# Altium schematic sheet CANOPi_Topboard_USB3.SchDoc
size A3; DocumentNumber: 2; SheetNumber: 2; SheetTotal: 2; CopyrightYear: 2021
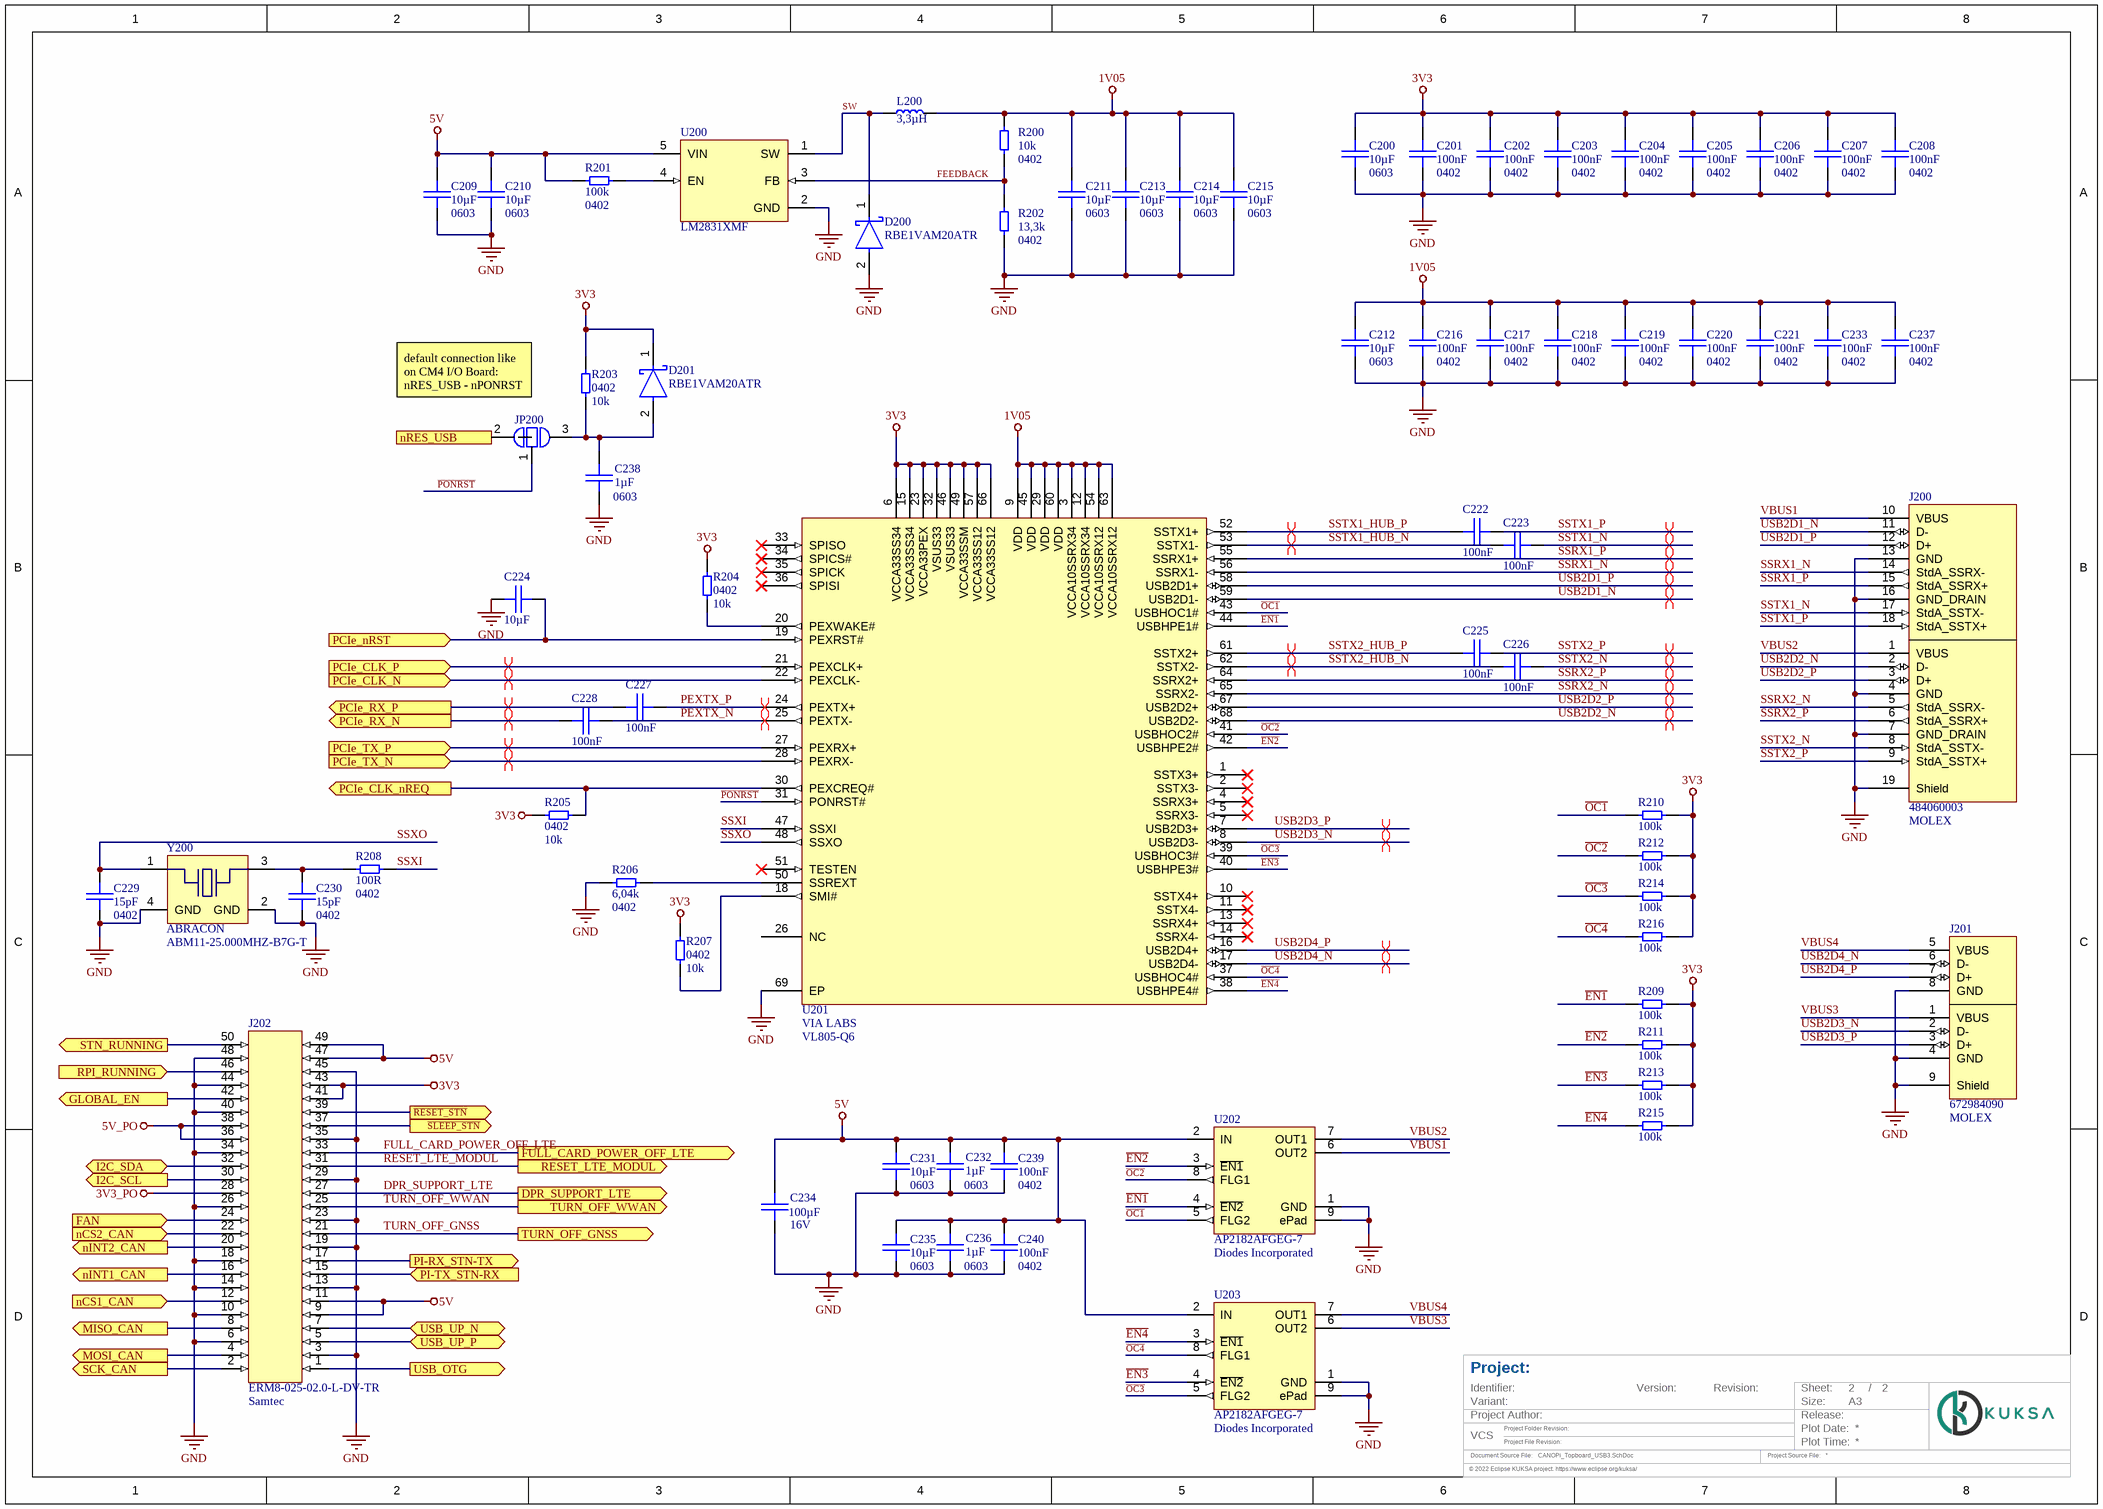
[diagram p0: CANOPi_Topboard_USB3.SchDoc]

## Parts
C200  Capacitance: 10µF  Case: 0603  [CAP 0603 [1608 Metric] X080 N]  (hidden comment: CAP 0603 10µF -20% +20% 6.3V X5R)
C201  Capacitance: 100nF  Case: 0402  [CAP 0402 [1005 Metric] X050 N]  (hidden comment: CAP 0402 100n -10% +10% 6.3V X7R)
C202  Capacitance: 100nF  Case: 0402  [CAP 0402 [1005 Metric] X050 N]  (hidden comment: CAP 0402 100n -10% +10% 6.3V X7R)
C203  Capacitance: 100nF  Case: 0402  [CAP 0402 [1005 Metric] X050 N]  (hidden comment: CAP 0402 100n -10% +10% 6.3V X7R)
C204  Capacitance: 100nF  Case: 0402  [CAP 0402 [1005 Metric] X050 N]  (hidden comment: CAP 0402 100n -10% +10% 6.3V X7R)
C205  Capacitance: 100nF  Case: 0402  [CAP 0402 [1005 Metric] X050 N]  (hidden comment: CAP 0402 100n -10% +10% 6.3V X7R)
C206  Capacitance: 100nF  Case: 0402  [CAP 0402 [1005 Metric] X050 N]  (hidden comment: CAP 0402 100n -10% +10% 6.3V X7R)
C207  Capacitance: 100nF  Case: 0402  [CAP 0402 [1005 Metric] X050 N]  (hidden comment: CAP 0402 100n -10% +10% 6.3V X7R)
C208  Capacitance: 100nF  Case: 0402  [CAP 0402 [1005 Metric] X050 N]  (hidden comment: CAP 0402 100n -10% +10% 6.3V X7R)
C209  Capacitance: 10µF  Case: 0603  [CAP 0603 [1608 Metric] X080 N]  (hidden comment: CAP 0603 10µF -20% +20% 6.3V X5R)
C210  Capacitance: 10µF  Case: 0603  [CAP 0603 [1608 Metric] X080 N]  (hidden comment: CAP 0603 10µF -20% +20% 6.3V X5R)
C211  Capacitance: 10µF  Case: 0603  [CAP 0603 [1608 Metric] X080 N]  (hidden comment: CAP 0603 10µF -20% +20% 6.3V X5R)
C212  Capacitance: 10µF  Case: 0603  [CAP 0603 [1608 Metric] X080 N]  (hidden comment: CAP 0603 10µF -20% +20% 6.3V X5R)
C213  Capacitance: 10µF  Case: 0603  [CAP 0603 [1608 Metric] X080 N]  (hidden comment: CAP 0603 10µF -20% +20% 6.3V X5R)
C214  Capacitance: 10µF  Case: 0603  [CAP 0603 [1608 Metric] X080 N]  (hidden comment: CAP 0603 10µF -20% +20% 6.3V X5R)
C215  Capacitance: 10µF  Case: 0603  [CAP 0603 [1608 Metric] X080 N]  (hidden comment: CAP 0603 10µF -20% +20% 6.3V X5R)
C216  Capacitance: 100nF  Case: 0402  [CAP 0402 [1005 Metric] X050 N]  (hidden comment: CAP 0402 100n -10% +10% 6.3V X7R)
C217  Capacitance: 100nF  Case: 0402  [CAP 0402 [1005 Metric] X050 N]  (hidden comment: CAP 0402 100n -10% +10% 6.3V X7R)
C218  Capacitance: 100nF  Case: 0402  [CAP 0402 [1005 Metric] X050 N]  (hidden comment: CAP 0402 100n -10% +10% 6.3V X7R)
C219  Capacitance: 100nF  Case: 0402  [CAP 0402 [1005 Metric] X050 N]  (hidden comment: CAP 0402 100n -10% +10% 6.3V X7R)
C220  Capacitance: 100nF  Case: 0402  [CAP 0402 [1005 Metric] X050 N]  (hidden comment: CAP 0402 100n -10% +10% 6.3V X7R)
C221  Capacitance: 100nF  Case: 0402  [CAP 0402 [1005 Metric] X050 N]  (hidden comment: CAP 0402 100n -10% +10% 6.3V X7R)
C222  Capacitance: 100nF  [CAP 0402 [1005 Metric] X050 N]  (hidden comment: CAP 0402 100n -10% +10% 6.3V X7R)
C223  Capacitance: 100nF  [CAP 0402 [1005 Metric] X050 N]  (hidden comment: CAP 0402 100n -10% +10% 6.3V X7R)
C224  Capacitance: 10µF  [CAP 0603 [1608 Metric] X080 N]  (hidden comment: CAP 0603 10µF -20% +20% 6.3V X5R)
C225  Capacitance: 100nF  [CAP 0402 [1005 Metric] X050 N]  (hidden comment: CAP 0402 100n -10% +10% 6.3V X7R)
C226  Capacitance: 100nF  [CAP 0402 [1005 Metric] X050 N]  (hidden comment: CAP 0402 100n -10% +10% 6.3V X7R)
C227  Capacitance: 100nF  [CAP 0402 [1005 Metric] X050 N]  (hidden comment: CAP 0402 100n -10% +10% 6.3V X7R)
C228  Capacitance: 100nF  [CAP 0402 [1005 Metric] X050 N]  (hidden comment: CAP 0402 100n -10% +10% 6.3V X7R)
C229  Case: 0402  Capacitance: 15pF  [CAP 0402 [1005 Metric] X050 N]  (hidden comment: CAP 0402 15p -2% +2% 25V C0G)
C230  Case: 0402  Capacitance: 15pF  [CAP 0402 [1005 Metric] X050 N]  (hidden comment: CAP 0402 15p -2% +2% 25V C0G)
C231  Capacitance: 10µF  Case: 0603  [CAP 0603 [1608 Metric] X080 N]  (hidden comment: CAP 0603 10µF -20% +20% 6.3V X5R)
C232  Capacitance: 1µF  Case: 0603  [CAP 0603 [1608 Metric] X080 N]  (hidden comment: CAP 0603 1u -10% +10% 10V X7R)
C233  Capacitance: 100nF  Case: 0402  [CAP 0402 [1005 Metric] X050 N]  (hidden comment: CAP 0402 100n -10% +10% 6.3V X7R)
C234  Voltage Rating: 16V  Capacitance: 100µF  [CAP 1210 [3225 Metric] X250 N]  (hidden comment: CAP 1210 100µF +/-20% 16V X5R)
C235  Capacitance: 10µF  Case: 0603  [CAP 0603 [1608 Metric] X080 N]  (hidden comment: CAP 0603 10µF -20% +20% 6.3V X5R)
C236  Capacitance: 1µF  Case: 0603  [CAP 0603 [1608 Metric] X080 N]  (hidden comment: CAP 0603 1u -10% +10% 10V X7R)
C237  Capacitance: 100nF  Case: 0402  [CAP 0402 [1005 Metric] X050 N]  (hidden comment: CAP 0402 100n -10% +10% 6.3V X7R)
C238  Capacitance: 1µF  Case: 0603  [CAP 0603 [1608 Metric] X080 N]  (hidden comment: CAP 0603 1u -10% +10% 10V X7R)
C239  Capacitance: 100nF  Case: 0402  [CAP 0402 [1005 Metric] X050 N]  (hidden comment: CAP 0402 100n -10% +10% 6.3V X7R)
C240  Capacitance: 100nF  Case: 0402  [CAP 0402 [1005 Metric] X050 N]  (hidden comment: CAP 0402 100n -10% +10% 6.3V X7R)
D200  RBE1VAM20ATR  [FP-TUMD2M-MFG]
D201  RBE1VAM20ATR  [FP-TUMD2M-MFG]
J200  Manufacturer Part Number: 484060003  Manufacturer: MOLEX  [MOLEX - 484060003]  (hidden comment: MOLEX - 484060003)
J201  Manufacturer Part Number: 672984090  Manufacturer: MOLEX  [MOLEX - 672984090]  (hidden comment: MOLEX - 672984090)
J202  Manufacturer Part Number: ERM8-025-02.0-L-DV-TR  Manufacturer: Samtec  [SAMTEC - ERM8-025-02.0-S-DV-TR-Footprint-1]  (hidden comment: SAMTEC - ERM8-025-02.0-L-DV-TR)
JP200  Solder Jumper Triple 0402 with Assembly between 1 and 2  [Solder Jumper Triple 0402 with Assembly between 1 and 2]  (value not drawn)
L200  Inductance: 3,3µH  [IFSC-1515AH]  (hidden comment: VISHAY - IFSC1515AHER3R3M01)
R200  Case: 0402  Resistance: 10k  [RES 0402 [1005 Metric]_N]  (hidden comment: RES 0402 10K 1% 0W0625)
R201  Resistance: 100k  Case: 0402  [RES 0402 [1005 Metric]_N]  (hidden comment: RES 0402 100K 1% 0W0625)
R202  Resistance: 13,3k  Case: 0402  [RES 0402 [1005 Metric]_N]  (hidden comment: RES 0402 13K3 1% 0W0625)
R203  Case: 0402  Resistance: 10k  [RES 0402 [1005 Metric]_N]  (hidden comment: RES 0402 10K 1% 0W0625)
R204  Case: 0402  Resistance: 10k  [RES 0402 [1005 Metric]_N]  (hidden comment: RES 0402 10K 1% 0W0625)
R205  Case: 0402  Resistance: 10k  [RES 0402 [1005 Metric]_N]  (hidden comment: RES 0402 10K 1% 0W0625)
R206  Resistance: 6,04k  Case: 0402  [RES 0402 [1005 Metric]_N]  (hidden comment: RES 0402 6K04 1% 0W0625)
R207  Case: 0402  Resistance: 10k  [RES 0402 [1005 Metric]_N]  (hidden comment: RES 0402 10K 1% 0W0625)
R208  Resistance: 100R  Case: 0402  [RES 0402 [1005 Metric]_N]  (hidden comment: RES 0402 100R 1% 63mW)
R209  Resistance: 100k  [RES 0402 [1005 Metric]_N]  (hidden comment: RES 0402 100K 1% 0W0625)
R210  Resistance: 100k  [RES 0402 [1005 Metric]_N]  (hidden comment: RES 0402 100K 1% 0W0625)
R211  Resistance: 100k  [RES 0402 [1005 Metric]_N]  (hidden comment: RES 0402 100K 1% 0W0625)
R212  Resistance: 100k  [RES 0402 [1005 Metric]_N]  (hidden comment: RES 0402 100K 1% 0W0625)
R213  Resistance: 100k  [RES 0402 [1005 Metric]_N]  (hidden comment: RES 0402 100K 1% 0W0625)
R214  Resistance: 100k  [RES 0402 [1005 Metric]_N]  (hidden comment: RES 0402 100K 1% 0W0625)
R215  Resistance: 100k  [RES 0402 [1005 Metric]_N]  (hidden comment: RES 0402 100K 1% 0W0625)
R216  Resistance: 100k  [RES 0402 [1005 Metric]_N]  (hidden comment: RES 0402 100K 1% 0W0625)
U200  LM2831XMF  [MF05A_N]
U201  Manufacturer: VIA LABS  Manufacturer Part Number: VL805-Q6  [QFN40P800X800X90_HS-69N]  (hidden comment: VIA LABS - VL805)
U202  Manufacturer Part Number: AP2182AFGEG-7  Manufacturer: Diodes Incorporated  [SON65P300X60_HS-9N]  (hidden comment: DIODES INCORPORATED - AP2182A)
U203  Manufacturer Part Number: AP2182AFGEG-7  Manufacturer: Diodes Incorporated  [SON65P300X60_HS-9N]  (hidden comment: DIODES INCORPORATED - AP2182A)
Y200  Manufacturer: ABRACON  Manufacturer Part Number: ABM11-25.000MHZ-B7G-T  [ABM11]  (hidden comment: ABRACON - ABM11-25.000MHZ-B7G-T)

## Ports
DPR_SUPPORT_LTE (out), FAN (in), FULL_CARD_POWER_OFF_LTE (out), GLOBAL_EN (out), I2C_SCL (out), I2C_SDA (bidir), MISO_CAN (out), MOSI_CAN (out), nCS1_CAN (in), nCS2_CAN (in), nINT1_CAN (out), nINT2_CAN (out), nRES_USB (in), PCIe_CLK_N (in), PCIe_CLK_nREQ (out), PCIe_CLK_P (in), PCIe_nRST (in), PCIe_RX_N (out), PCIe_RX_P (out), PCIe_TX_N (in), PCIe_TX_P (in), PI-RX_STN-TX (out), PI-TX_STN-RX (in), RESET_LTE_MODUL (out), RPI_RUNNING (in), SCK_CAN (out), STN_RUNNING (out), TURN_OFF_GNSS (out), TURN_OFF_WWAN (out), USB_OTG (out), USB_UP_N (bidir), USB_UP_P (bidir), ~{RESET_STN} (out), ~{SLEEP_STN} (out)

## Nets
1V05: C211.1 C212.1 C213.1 C214.1 C215.1 C216.1 C217.1 C218.1 C219.1 C220.1 C221.1 C233.1 C237.1 L200.2 R200.1 U201.3(VCCA10SSRX34) U201.9(VDD) U201.12(VCCA10SSRX34) U201.29(VDD) U201.45(VDD) U201.54(VCCA10SSRX12) U201.60(VDD) U201.63(VCCA10SSRX12)
3V3: C200.1 C201.1 C202.1 C203.1 C204.1 C205.1 C206.1 C207.1 C208.1 D201.1(C) J202.41 J202.43 R203.2 R204.1 R205.1 R207.1 R209.1 R210.1 R211.1 R212.1 R213.1 R214.1 R215.1 R216.1 U201.6(VCCA33SS34) U201.15(VCCA33SS34) U201.23(VCCA33PEX) U201.32(VSUS33) U201.46(VSUS33) U201.49(VCCA33SSM) U201.57(VCCA33SS12) U201.66(VCCA33SS12)
3V3_PO: J202.28
5V: C209.1 C210.1 C231.1 C232.1 C234.2 C235.1 C236.1 C239.1 C240.1 J202.9 J202.11 J202.47 J202.49 R201.2 U200.5(VIN) U202.2(IN) U203.2(IN)
5V_PO: J202.36 J202.38
GND: C200.2 C201.2 C202.2 C203.2 C204.2 C205.2 C206.2 C207.2 C208.2 C209.2 C210.2 C211.2 C212.2 C213.2 C214.2 C215.2 C216.2 C217.2 C218.2 C219.2 C220.2 C221.2 C224.2 C229.1 C230.1 C231.2 C232.2 C233.2 C234.1 C235.2 C236.2 C237.2 C238.2 C239.2 C240.2 D200.2(A) J200.4(GND) J200.7(GND_DRAIN) J200.13(GND) J200.16(GND_DRAIN) J200.19(Shield) J201.4(GND) J201.8(GND) J201.9(Shield) J202.3 J202.6 J202.10 J202.13 J202.14 J202.18 J202.19 J202.23 J202.26 J202.29 J202.34 J202.35 J202.40 J202.44 J202.45 J202.48 R202.1 R206.1 U200.2(GND) U201.69(EP) U202.1(GND) U202.9(ePad) U203.1(GND) U203.9(ePad) Y200.2(GND) Y200.4(GND)
~{EN1}: R209.2 U201.44(USBHPE1#) U202.4(~{EN2})
~{EN2}: R211.2 U201.42(USBHPE2#) U202.3(~{EN1})
~{EN3}: R213.2 U201.40(USBHPE3#) U203.4(~{EN2})
~{EN4}: R215.2 U201.38(USBHPE4#) U203.3(~{EN1})
~{OC1}: R210.2 U201.43(USBHOC1#) U202.5(FLG2)
~{OC2}: R212.2 U201.41(USBHOC2#) U202.8(FLG1)
~{OC3}: R214.2 U201.39(USBHOC3#) U203.5(FLG2)
~{OC4}: R216.2 U201.37(USBHOC4#) U203.8(FLG1)
~{PONRST}: JP200.1 U201.31(PONRST#)
~{RESET_STN}: J202.39 ; port ~{RESET_STN}
~{SLEEP_STN}: J202.37 ; port ~{SLEEP_STN}
DPR_SUPPORT_LTE: J202.27 ; port DPR_SUPPORT_LTE
FAN: J202.24 ; port FAN
FEEDBACK: R200.2 R202.2 U200.3(FB)
FULL_CARD_POWER_OFF_LTE: J202.33 ; port FULL_CARD_POWER_OFF_LTE
GLOBAL_EN: J202.42 ; port GLOBAL_EN
I2C_SCL: J202.30 ; port I2C_SCL
I2C_SDA: J202.32 ; port I2C_SDA
MISO_CAN: J202.8 ; port MISO_CAN
MOSI_CAN: J202.4 ; port MOSI_CAN
nCS1_CAN: J202.12 ; port nCS1_CAN
nCS2_CAN: J202.22 ; port nCS2_CAN
nINT1_CAN: J202.16 ; port nINT1_CAN
nINT2_CAN: J202.20 ; port nINT2_CAN
nRES_USB: JP200.2 ; port nRES_USB
PCIe_CLK_N: U201.22(PEXCLK-) ; port PCIe_CLK_N
PCIe_CLK_nREQ: R205.2 U201.30(PEXCREQ#) ; port PCIe_CLK_nREQ
PCIe_CLK_P: U201.21(PEXCLK+) ; port PCIe_CLK_P
PCIe_nRST: C224.1 U201.19(PEXRST#) ; port PCIe_nRST
PCIe_RX_N: C228.2 ; port PCIe_RX_N
PCIe_RX_P: C227.2 ; port PCIe_RX_P
PCIe_TX_N: U201.28(PEXRX-) ; port PCIe_TX_N
PCIe_TX_P: U201.27(PEXRX+) ; port PCIe_TX_P
PEXTX_N: C228.1 U201.25(PEXTX-)
PEXTX_P: C227.1 U201.24(PEXTX+)
PI-RX_STN-TX: J202.17 ; port PI-RX_STN-TX
PI-TX_STN-RX: J202.15 ; port PI-TX_STN-RX
RESET_LTE_MODUL: J202.31 ; port RESET_LTE_MODUL
RPI_RUNNING: J202.46 ; port RPI_RUNNING
SCK_CAN: J202.2 ; port SCK_CAN
SSRX1_N: J200.14(StdA_SSRX-) U201.56(SSRX1-)
SSRX1_P: J200.15(StdA_SSRX+) U201.55(SSRX1+)
SSRX2_N: J200.5(StdA_SSRX-) U201.65(SSRX2-)
SSRX2_P: J200.6(StdA_SSRX+) U201.64(SSRX2+)
SSTX1_HUB_N: C223.2 U201.53(SSTX1-)
SSTX1_HUB_P: C222.2 U201.52(SSTX1+)
SSTX1_N: C223.1 J200.17(StdA_SSTX-)
SSTX1_P: C222.1 J200.18(StdA_SSTX+)
SSTX2_HUB_N: C226.2 U201.62(SSTX2-)
SSTX2_HUB_P: C225.2 U201.61(SSTX2+)
SSTX2_N: C226.1 J200.8(StdA_SSTX-)
SSTX2_P: C225.1 J200.9(StdA_SSTX+)
SSXI: R208.1 U201.47(SSXI)
SSXO: C229.2 U201.48(SSXO) Y200.1
STN_RUNNING: J202.50 ; port STN_RUNNING
SW: D200.1(C) L200.1 U200.1(SW)
TURN_OFF_GNSS: J202.21 ; port TURN_OFF_GNSS
TURN_OFF_WWAN: J202.25 ; port TURN_OFF_WWAN
USB2D1_N: J200.11(D-) U201.59(USB2D1-)
USB2D1_P: J200.12(D+) U201.58(USB2D1+)
USB2D2_N: J200.2(D-) U201.68(USB2D2-)
USB2D2_P: J200.3(D+) U201.67(USB2D2+)
USB2D3_N: J201.2(D-) U201.8(USB2D3-)
USB2D3_P: J201.3(D+) U201.7(USB2D3+)
USB2D4_N: J201.6(D-) U201.17(USB2D4-)
USB2D4_P: J201.7(D+) U201.16(USB2D4+)
USB_OTG: J202.1 ; port USB_OTG
USB_UP_N: J202.7 ; port USB_UP_N
USB_UP_P: J202.5 ; port USB_UP_P
VBUS1: J200.10(VBUS) U202.6(OUT2)
VBUS2: J200.1(VBUS) U202.7(OUT1)
VBUS3: J201.1(VBUS) U203.6(OUT2)
VBUS4: J201.5(VBUS) U203.7(OUT1)
NetC230_2: C230.2 R208.2 Y200.3
NetC238_1: C238.1 D201.2(A) JP200.3 R203.1
NetR201_1: R201.1 U200.4(EN)
NetR204_2: R204.2 U201.20(PEXWAKE#)
NetR206_2: R206.2 U201.50(SSREXT)
NetR207_2: R207.2 U201.18(SMI#)

Not connected (* = marked no-connect by the designer): U201 1(SSTX3+)* 2(SSTX3-)* 4(SSRX3+)* 5(SSRX3-)* 10(SSTX4+)* 11(SSTX4-)* 13(SSRX4+)* 14(SSRX4-)* 26(NC) 33(SPISO)* 34(SPICS#)* 35(SPICK)* 36(SPISI)* 51(TESTEN)*

## Layout directives
differential pair: PCIe_CLK_N, PCIe_CLK_P, PCIe_RX_N, PCIe_RX_P, PCIe_TX_N, PCIe_TX_P, PEXTX_N, PEXTX_P, SSRX1_N, SSRX1_P, SSRX2_N, SSRX2_P, SSTX1_HUB_N, SSTX1_HUB_P, SSTX1_N, SSTX1_P, SSTX2_HUB_N, SSTX2_HUB_P, SSTX2_N, SSTX2_P, USB2D1_N, USB2D1_P, USB2D2_N, USB2D2_P, USB2D3_N, USB2D3_P, USB2D4_N, USB2D4_P

## Notes on the sheet
- default connection like on CM4 I/O Board: nRES_USB - nPONRST
- Project:
- Identifier:
- Version:
- Revision:
- Sheet:
- /
- VCS
- Variant:
- Document Source File:
- Project Author:
- Project Folder Revision:
- Project File Revision:
- Project Source File:
- Plot Date:
- Size:
- Plot Time:
- Release:
- A3
- © 2022 Eclipse KUKSA project. https://www.eclipse.org/kuksa/
- Drawn by:
- © Robert Bosch GmbH         . All rights reserved, also regarding any disposal, exploitation, reproduction, editing, distribution, as well as in the event of applications for industrial property rights.

## Library data of the parts
C200 C209-C215 C224 C231 C235 = CMP-06061-3: SMT 10µF ±20% 6,3 V Keramikkondensatoren X5R; Manufacturer Part Number: GRM188R60J106ME84; Manufacturer: MURATA; Voltage Rating: 6,3V; Assembly: yes; Operating Temperature max: 85°C; IPC Footprint Naming: CAPC1608X080; Mounting Type: SMT; Dielectric Type: X5R; Value: 10µF; ComponentLink1Description: Datasheet; Capacitance Tolerance pos: 20%; ComponentLink1URL: https://search.murata.co.jp/Ceramy/image/img/A01X/G101/ENG/GRM188R60J106ME84-01.pdf; Operating Temperature min: -55°C; Capacitance Tolerance neg: -20%
  C224: Case: 0603 [1608]
C201-C208 C216-C223 C225-C228 C233 C237 C239 C240 = CMP-04212-4: SMD/SMT 0402 6.3V -10% +10% X7R - Multilayer Ceramic Capacitors MLCC; Manufacturer: MURATA; Manufacturer Part Number: GRM155R70J104KA01#; Capacitance Tolerance pos: 10%; Value: 100nF; Assembly: yes; Operating Temperature min: -55°C; Voltage Rating: 6.3V; Operating Temperature max: 125°C; ComponentLink1URL: http://psearch.en.murata.com/capacitor/lineup/grm/; IPC Footprint Naming: CAPC1005X050; Capacitance Tolerance neg: -10%; ComponentLink1Description: Datasheet; Dielectric Type: X7R; Mounting Type: SMT
  C222 C223 C225-C228: Case: 0402
C229 C230 = CMP-03766-4: SMD/SMT 0402 25V -2% +2% C0G - Multilayer Ceramic Capacitors MLCC; Manufacturer: MURATA; Manufacturer Part Number: GRM1555C1E150GA01#; Capacitance Tolerance pos: 2%; Value: 15pF; Dielectric Type: C0G (NP0); Assembly: yes; Mounting Type: SMT; Operating Temperature max: 125°C; ComponentLink1Description: Datasheet; IPC Footprint Naming: CAPC1005X050; Voltage Rating: 25V; ComponentLink1URL: http://psearch.en.murata.com/capacitor/lineup/grm/; Capacitance Tolerance neg: -2%; Operating Temperature min: -55°C
C232 C236 C238 = CMP-02997-5: SMD/SMT 0603 10V -10% +10% X7R - Multilayer Ceramic Capacitors MLCC; Manufacturer Part Number: GRM188R71A105KA61#; Manufacturer: MURATA; Capacitance Tolerance pos: 10%; Value: 1µF; Assembly: yes; IPC Footprint Naming: CAPC1608X080; Voltage Rating: 10V; Mounting Type: SMT; Operating Temperature max: 125°C; Operating Temperature min: -55°C; ComponentLink1Description: Datasheet; Capacitance Tolerance neg: -10%; ComponentLink1URL: http://psearch.en.murata.com/capacitor/lineup/grm/; Dielectric Type: X7R
C234 = CMP-10010-2: 100µF ±20% 16V Ceramic Capacitor X5R 1210 (3225 Metric); Manufacturer Part Number: EMK325ABJ107MM-T; Manufacturer: TAIYO YUDEN; Assembly: yes; Capacitance Tolerance neg: -20%; Dielectric Type: X5R; Operating Temperature min: -55°C; Capacitance Tolerance pos: 20%; ComponentLink1Description: Manufacturer Link; Mounting Type: SMT; Operating Temperature max: 85°C; Case: 1210 [3225]; ComponentLink1URL: https://www.yuden.co.jp/productdata/catalog/mlcc06_e.pdf; Value: 100µF
D200 D201 = CMP-08971-000009-1: DIODE SCHOTTKY 20V 1A TUMD2M; Manufacturer: Rohm; Max Repetitive Reverse Voltage: 30V; Peak Reverse Current: 200uA; Max Surge Forward Current: 3A; Max Junction Temp: +125°C; Category: Diode; Manufacturer Part Number: RBE1VAM20ATR; Automotive: No; Height: 0.8mm; ComponentLink2Description: Datasheet; Device Class L1: Discrete Semiconductors; Device Class L2: Diodes; Digikey Description: DIODE SCHOTTKY 20V 1A TUMD2M; Octopart: https://octopart.com/rbe1vam20atr-rohm-50418626; RoHS: TRUE; Lead Free: Yes; Package: TUMD2M; Device Class L3: Schottky Diodes; ComponentLink2URL: https://www.rohm.com/datasheet/RBE1VAM20A/rbe1vam20atr-e; Reverse Voltage: 20V; Forward Current: 1A
J200 = CMP-11209-3: Universal Serial Bus (USB 3.0) I/O Receptacle, Dual Port Stacked, Right-Angle, TypeA, High-Temperature Blue Nylon, 0.38¿m Gold (Au) Plating, Contact Height 4.13mm; Current Rating: 1,8A; Voltage Rating: 30V; Gender: Female; Pitch Spacing: 2mm; Assembly: yes; ComponentLink1Description: Manufacturer Link; Contact Plating: 0.38¿m Gold (Au) Plating; ComponentLink1URL: https://www.molex.com/molex/products/part-detail/io_connectors/0484060003; Number of Pins: 22; Operating Temperature min: -20°C; Number of Rows: 0; Mounting Type: THT; Operating Temperature max: 85°C
J201 = CMP-11205-2: Universal Serial Bus (USB) Shielded I/O Receptacle, Right-Angle, Dual Stacked, Type A, Gold (Au) Flash, White Housing, with 4 Beveled Metal Pins, Lead-Free; Pitch Spacing: 2mm; Assembly: yes; Gender: Female; Current Rating: 1,5A; Voltage Rating: 30V; Number of Pins: 13; ComponentLink1URL: https://www.molex.com/molex/products/part-detail/io_connectors/0672984090; ComponentLink1Description: Manufacturer Link; Contact Plating: Gold; Mounting Type: THT; Number of Rows: 0; Operating Temperature max: 50°C; Operating Temperature min: 0°C
J202 = CMP-11270-3: 50 Poliger Steckverbinder Steckleiste, Mittenstreifenkontakte Oberflächenmontage Gold; Pitch Spacing: 800µm; System: Connector; Assembly: yes; Voltage Rating: 200V; Current Rating: 1,1A; Gender: Male; ComponentLink1Description: Manufacturer Link; Number of Pins: 50; Operating Temperature min: -40°C; Operating Temperature max: 150°C; ComponentLink1URL: https://www.samtec.com/products/erm8-025-02.0-l-dv-tr; Number of Rows: 2; Mounting Type: SMT
JP200 = CMP-04522-6: Manufacturer: YAGEO; Manufacturer Part Number: RC0402JR-070RL; Operating Temperature max: 0°C; Mounting Type: SMT; Assembly: between 1 and 2; ComponentLink1Description: Datasheet; Operating Temperature min: 0°C; Case: 0402 Triple
L200 = CMP-11169-1: Low Profile, High Current Inductor; Inductance Tolerance: 20; Resistance DC max: 56m; Self Resonance Frequency min: 0Hz; Assembly: yes; Value: 3,3µH; Current Rating DC/RMS: 2,75A; Operating Temperature max: 125°C; Case: 1515; Mounting Type: SMT; ComponentLink1Description: Manufacturer Link; Manufacturer Part Number: IFSC1515AHER3R3M01; Manufacturer: VISHAY; Operating Temperature min: -55°C
R200 R203-R205 R207 = CMP-00958-6: RC0402 series chip resistor with lead-free terminations made by thick film process; Manufacturer Part Number: RC0402FR-0710KL; Manufacturer: YAGEO; Voltage Rating: 50V; Temperature Coefficient: ±100ppm/K; Assembly: yes; Current Rating: 1A; Power Rating: 62.5mW; Resistance Tolerance: 1%; Value: 10k; Resistor Element Type: Thick Film; ComponentLink1Description: Datasheet; IPC Footprint Naming: RESC1005X04; Mounting Type: SMT; ComponentLink1URL: http://www.yageo.com/documents/recent/PYu-RC0402_51_RoHS_L_6.pdf; Operating Temperature min: -55°C; Operating Temperature max: 155°C
R201 R209-R216 = CMP-01074-5: RC0402 series chip resistor with lead-free terminations made by thick film process; Manufacturer Part Number: RC0402FR-07100KL; Manufacturer: YAGEO; Temperature Coefficient: ±100ppm/K; Current Rating: 1A; Assembly: yes; Power Rating: 62.5mW; Voltage Rating: 50V; Mounting Type: SMT; ComponentLink1URL: http://www.yageo.com/documents/recent/PYu-RC0402_51_RoHS_L_6.pdf; Operating Temperature max: 155°C; Operating Temperature min: -55°C; Resistor Element Type: Thick Film; IPC Footprint Naming: RESC1005X04; ComponentLink1Description: Datasheet; Value: 100k; Resistance Tolerance: 1%
  R209-R216: Case: 0402
R202 = CMP-00972-6: RC0402 series chip resistor with lead-free terminations made by thick film process; Manufacturer: YAGEO; Manufacturer Part Number: RC0402FR-0713K3L; Value: 13,3k; Current Rating: 1A; Assembly: yes; Power Rating: 62,5mW; Temperature Coefficient: ±100ppm/K; Voltage Rating: 50V; Resistance Tolerance: 1%; IPC Footprint Naming: RESC1005X04; Mounting Type: SMT; Operating Temperature max: 155°C; ComponentLink1URL: http://www.yageo.com/documents/recent/PYu-RC0402_51_RoHS_L_6.pdf; Resistor Element Type: Thick Film; Operating Temperature min: -55°C; ComponentLink1Description: Datasheet
R206 = CMP-00933-6: RC0402 series chip resistor with lead-free terminations made by thick film process; Manufacturer: YAGEO; Manufacturer Part Number: RC0402FR-076K04L; Voltage Rating: 50V; Value: 6,04k; Current Rating: 1A; Power Rating: 62,5mW; Temperature Coefficient: ±100ppm/K; Assembly: yes; Operating Temperature min: -55°C; Resistor Element Type: Thick Film; IPC Footprint Naming: RESC1005X04; ComponentLink1Description: Datasheet; Operating Temperature max: 155°C; Mounting Type: SMT; Resistance Tolerance: 1%; ComponentLink1URL: http://www.yageo.com/documents/recent/PYu-RC0402_51_RoHS_L_6.pdf
R208 = CMP-06970-3: RC0402 series chip resistor with lead-free terminations made by thick film process; Manufacturer: ROHM; Manufacturer Part Number: MCR01MZPF100; Assembly: yes; Temperature Coefficient: ±100ppm/K; eADM Name: 8905501369; Voltage Rating: 50V; Value: 100; Current Rating: 1A; IPC Footprint Naming: RESC1005X04; Operating Temperature min: -55°C; Resistor Element Type: Thick Film; Resistance Tolerance: 1%; ComponentLink1URL: https://www.rohm.com/site-search?p_p_id=rohmsitesearch_WAR_rohmcomboportlet&p_p_lifecycle=1&p_p_state=normal&_rohmsitesearch_WAR_rohmcomboportlet_action=siteSearchAction&p_auth=xKaajgv6; ComponentLink1Description: Datasheet; Operating Temperature max: 155°C; Power Rating: 63mW; Mounting Type: SMT
U200 = CMP-0069-01177-2: High Frequency 1.5A Load - Step-Down DC-DC Regulator, 5-pin SOT-23; Manufacturer: National Semiconductor; PowerWise: N; CompType: Switcher; PackageTopMarking: SKYB*XTT; ComponentLink3Description: MF05A Package Page; RoHS: N; ComponentLink1URL: http://www.national.com/ds/LM/LM2831.pdf; ComponentLink1Description: LM2831 Datasheet; ComponentLink2Description: LM2831 Web Page; ComponentLink2URL: http://www.national.com/pf/LM/LM2831.html; DatasheetVersion: Aug-2006; ComponentLink3URL: http://www.national.com/packaging/folders/mf05a.html; PackageVersion: revD, Aug-2008; PackageDescription: Molded SOT-23, .115 x .063 x .040 in Body, 5 Lead, .0375 in Pitch; RevisionNote: Component URLs added; PinCount: 5; PackageReference: MF05A
U201 = CMP-11157-2: VL805 4-Port USB 3.0 Host Controller; USB Version: 3.0; Assembly: yes; No. of USB Ports: 4; Supply Voltage max: 3,6V; USB Speed Modes: Low-Speed to Super-Speed; Data Rate max: 5 Gbps (Super-Speed); Supply Voltage min: 3V; Interface Type: PCIe; Operating Temperature max: 70°C; Operating Temperature min: 0°C; ComponentLink1Description: Manufacturer Link; Case: QFN-68; Mounting Type: SMT
U202 U203 = CMP-11264-2: Power Switch/Driver 1:2 P-Channel 1.5A U-DFN3030-8 (Type E); No. of Outputs: 2; Assembly: yes; Output Current max: 1,5A; Input Voltage max: 5,5V; Input Voltage min: 2,7V; ComponentLink1Description: Manufacturer Link; Case: DFN; Operating Temperature min: -40°C; Mounting Type: SMT; ComponentLink1URL: https://www.diodes.com/part/view/AP2182; Operating Temperature max: 85°C
Y200 = CMP-06156-2: 25.000MHz ±15ppm Crystal 10pF 100 Ohm -20°C +70°C Surface Mount 4-SMD, No Lead (DFN, LCC); Frequency: 25MHz; Motional Resistance (ESR): 100; Shunt Capacitance (C0): 7pF; Assembly: yes; Frequency Tolerance: 15ppm; Frequency Stability: 15ppm; Load Capacitance (CL): 10pF; Mounting Type: SMT; Operating Temperature max: 70°C; Operating Temperature min: -20°C; Case: 4-SMD; ComponentLink1Description: Datasheet; ComponentLink1URL: http://www.abracon.com/Resonators/ABM11.pdf